# EAGLE design B204X (EAGLE 6.6.0)
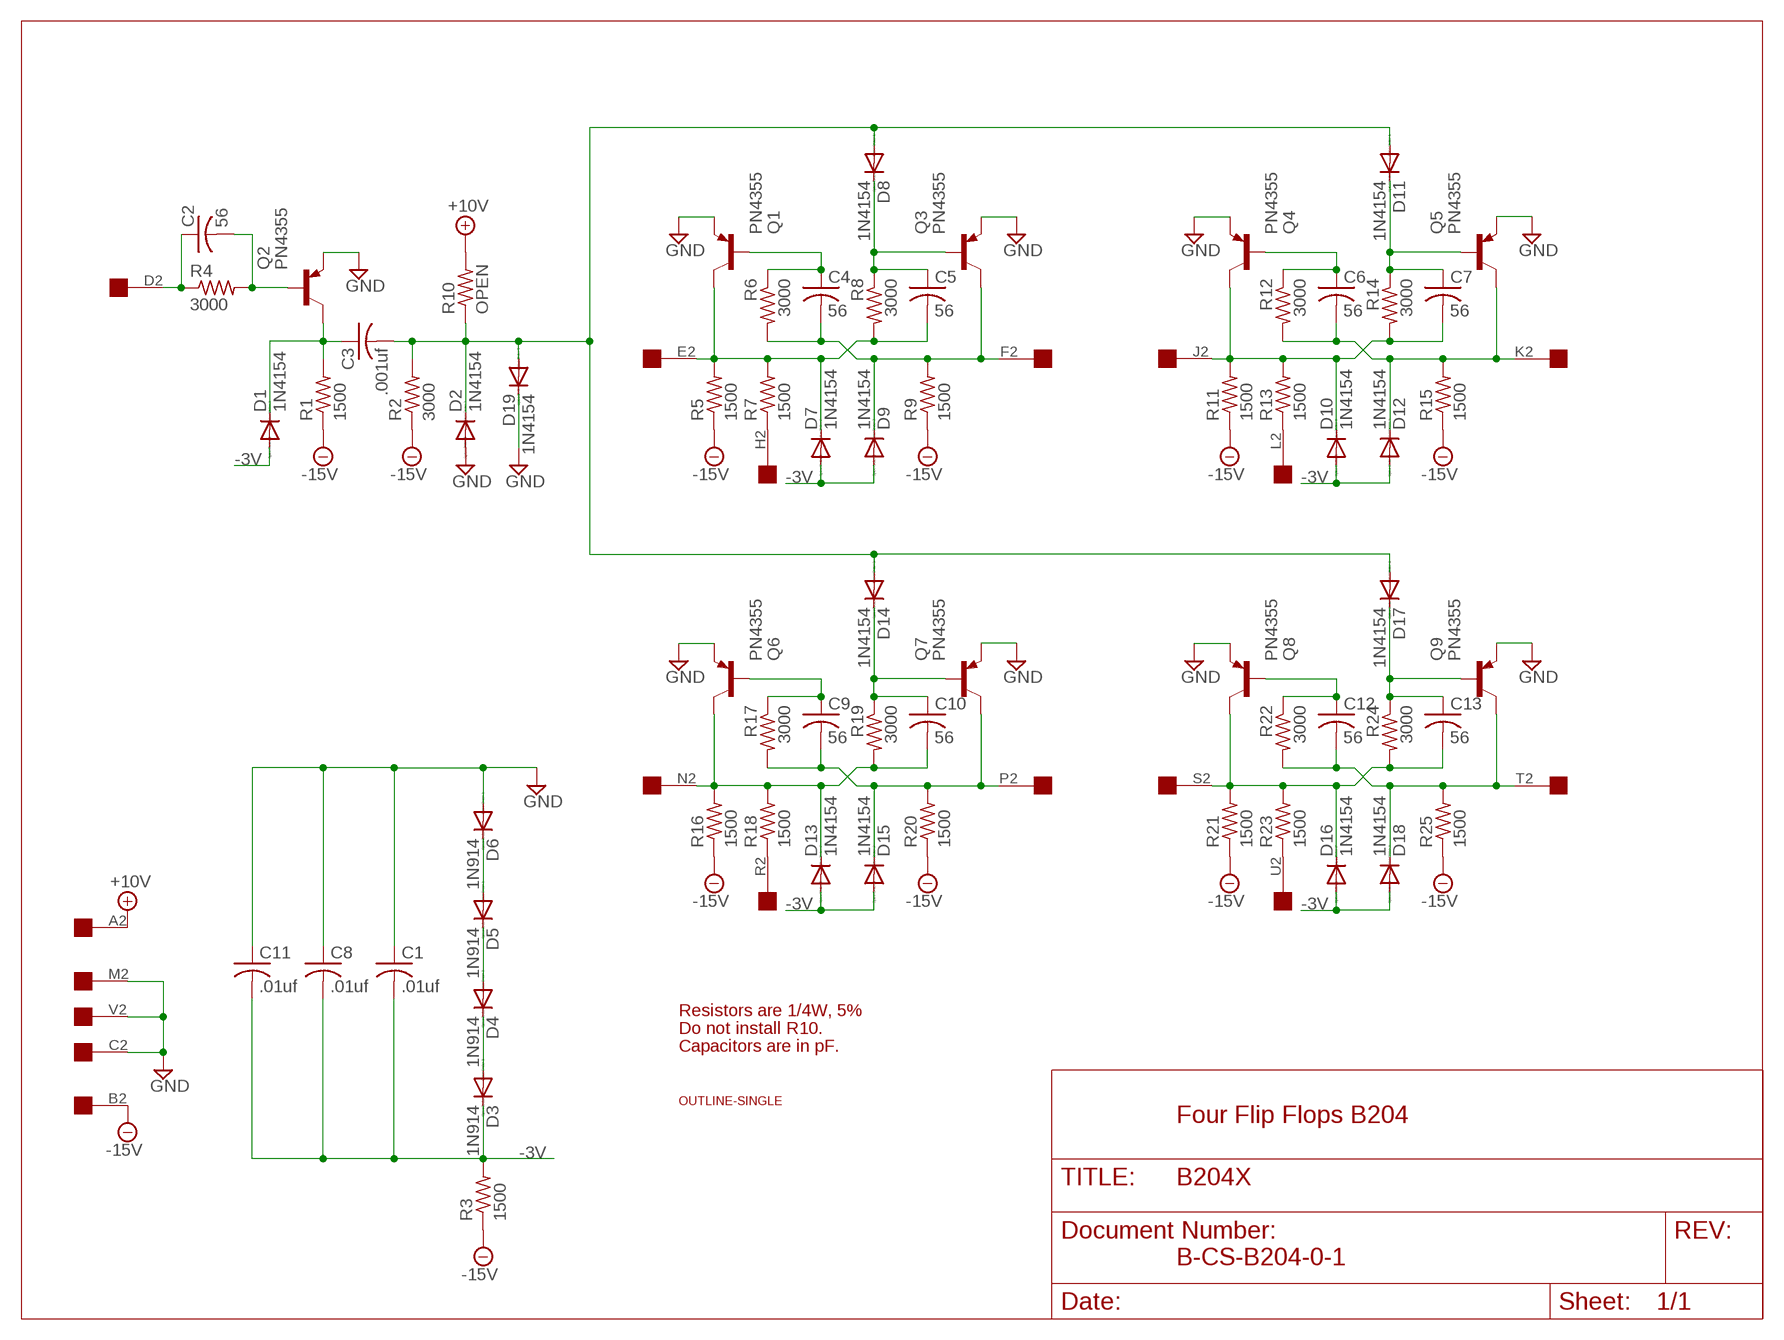
[diagram p0: schematic, sheet 1]

## Parts
C1  .01uf  C-US050-025X075  [C050-025X075]
C2  56  C-US075-032X103  [C075-032X103]
C3  .001uf  C-US050-025X075  [C050-025X075]
C4  56  C-US075-032X103  [C075-032X103]
C5  56  C-US075-032X103  [C075-032X103]
C6  56  C-US075-032X103  [C075-032X103]
C7  56  C-US075-032X103  [C075-032X103]
C8  .01uf  C-US050-025X075  [C050-025X075]
C9  56  C-US075-032X103  [C075-032X103]
C10  56  C-US075-032X103  [C075-032X103]
C11  .01uf  C-US050-025X075  [C050-025X075]
C12  56  C-US075-032X103  [C075-032X103]
C13  56  C-US075-032X103  [C075-032X103]
D1  1N4154  1N4148DO35-10  [DO35-10]
D2  1N4154  1N4148DO35-10  [DO35-10]
D3  1N914  1N4148DO35-10  [DO35-10]
D4  1N914  1N4148DO35-10  [DO35-10]
D5  1N914  1N4148DO35-10  [DO35-10]
D6  1N914  1N4148DO35-10  [DO35-10]
D7  1N4154  1N4148DO35-10  [DO35-10]
D8  1N4154  1N4148DO35-10  [DO35-10]
D9  1N4154  1N4148DO35-10  [DO35-10]
D10  1N4154  1N4148DO35-10  [DO35-10]
D11  1N4154  1N4148DO35-10  [DO35-10]
D12  1N4154  1N4148DO35-10  [DO35-10]
D13  1N4154  1N4148DO35-10  [DO35-10]
D14  1N4154  1N4148DO35-10  [DO35-10]
D15  1N4154  1N4148DO35-10  [DO35-10]
D16  1N4154  1N4148DO35-10  [DO35-10]
D17  1N4154  1N4148DO35-10  [DO35-10]
D18  1N4154  1N4148DO35-10  [DO35-10]
D19  1N4154  1N4148DO35-10  [DO35-10]
Q1  PN4355  2N3637  [TO39]
Q2  PN4355  2N3637  [TO39]
Q3  PN4355  2N3637  [TO39]
Q4  PN4355  2N3637  [TO39]
Q5  PN4355  2N3637  [TO39]
Q6  PN4355  2N3637  [TO39]
Q7  PN4355  2N3637  [TO39]
Q8  PN4355  2N3637  [TO39]
Q9  PN4355  2N3637  [TO39]
R1  1500  R-US_0207/10  [0207/10]
R2  3000  R-US_0207/10  [0207/10]
R3  1500  R-US_0207/10  [0207/10]
R4  3000  R-US_0207/10  [0207/10]
R5  1500  R-US_0207/10  [0207/10]
R6  3000  R-US_0207/10  [0207/10]
R7  1500  R-US_0207/10  [0207/10]
R8  3000  R-US_0207/10  [0207/10]
R9  1500  R-US_0207/10  [0207/10]
R10  OPEN  R-US_0207/10  [0207/10]
R11  1500  R-US_0207/10  [0207/10]
R12  3000  R-US_0207/10  [0207/10]
R13  1500  R-US_0207/10  [0207/10]
R14  3000  R-US_0207/10  [0207/10]
R15  1500  R-US_0207/10  [0207/10]
R16  1500  R-US_0207/10  [0207/10]
R17  3000  R-US_0207/10  [0207/10]
R18  1500  R-US_0207/10  [0207/10]
R19  3000  R-US_0207/10  [0207/10]
R20  1500  R-US_0207/10  [0207/10]
R21  1500  R-US_0207/10  [0207/10]
R22  3000  R-US_0207/10  [0207/10]
R23  1500  R-US_0207/10  [0207/10]
R24  3000  R-US_0207/10  [0207/10]
R25  1500  R-US_0207/10  [0207/10]
U$1  OUTLINE-SINGLE  [SINGLE]
U$2  EDGE-1  [EDGE-CON1]

## Nets
+10V [Power]: R10.2 U$2.A2
-3V [Power]: C1.2 C8.2 C11.2 D1.A D3.C D7.A D9.A D10.A D12.A D13.A D15.A D16.A D18.A R3.2
-15V [Power]: R1.1 R2.1 R3.1 R5.1 R9.1 R11.1 R15.1 R16.1 R20.1 R21.1 R25.1 U$2.B2
GND [Power]: C1.1 C8.1 C11.1 D2.A D6.A D19.C Q1.1(E) Q2.1(E) Q3.1(E) Q4.1(E) Q5.1(E) Q6.1(E) Q7.1(E) Q8.1(E) Q9.1(E) U$2.C2 U$2.M2 U$2.V2
N$1: C2.1 R4.1 U$2.D2
N$2: C4.1 Q1.2(B) R6.1
N$3: C2.2 Q2.2(B) R4.2
N$4: C3.1 D1.C Q2.3(C) R1.2
N$5: R7.1 U$2.H2
N$6: C5.2 D7.C Q1.3(C) R5.2 R7.2 R8.2 U$2.E2
N$7: C5.1 D8.C Q3.2(B) R8.1
N$8: C3.2 D2.C D8.A D11.A D14.A D17.A D19.A R2.2 R10.1
N$9: C4.2 D9.C Q3.3(C) R6.2 R9.2 U$2.F2
N$10: R13.1 U$2.L2
N$12: C6.1 Q4.2(B) R12.1
N$13: D4.A D5.C
N$14: C7.1 D11.C Q5.2(B) R14.1
N$15: C7.2 D10.C Q4.3(C) R11.2 R13.2 R14.2 U$2.J2
N$16: D3.A D4.C
N$17: C6.2 D12.C Q5.3(C) R12.2 R15.2 U$2.K2
N$18: R18.1 U$2.R2
N$20: C9.1 Q6.2(B) R17.1
N$21: C10.1 D14.C Q7.2(B) R19.1
N$22: C10.2 D13.C Q6.3(C) R16.2 R18.2 R19.2 U$2.N2
N$23: C9.2 D15.C Q7.3(C) R17.2 R20.2 U$2.P2
N$24: R23.1 U$2.U2
N$26: C12.1 Q8.2(B) R22.1
N$27: C13.1 D17.C Q9.2(B) R24.1
N$28: C13.2 D16.C Q8.3(C) R21.2 R23.2 R24.2 U$2.S2
N$29: C12.2 D18.C Q9.3(C) R22.2 R25.2 U$2.T2
N$31: D5.A D6.C

## Notes on the sheet
- Resistors are 1/4W, 5%
- Do not install R10.
- Capacitors are in pF.
- Four Flip Flops B204
- B-CS-B204-0-1

## Library data of the parts
C1-C13 = rcl:C-US: CAPACITOR, American symbol
D1-D19 = diode:1N4148: DIODE high speed (Philips)
Q1-Q9 = transistor-pnp:2N3637*: PNP Transistror
R1-R25 = rcl:R-US_: RESISTOR, American symbol
U$1 = dec-con:OUTLINE-*: Board outlines for DEC boards.
U$2 = dec-con:EDGE-1: Single-Sided DEC Edge Connector -- (side 2)

## Net classes
1 Power: width 0.813 mm

## Board
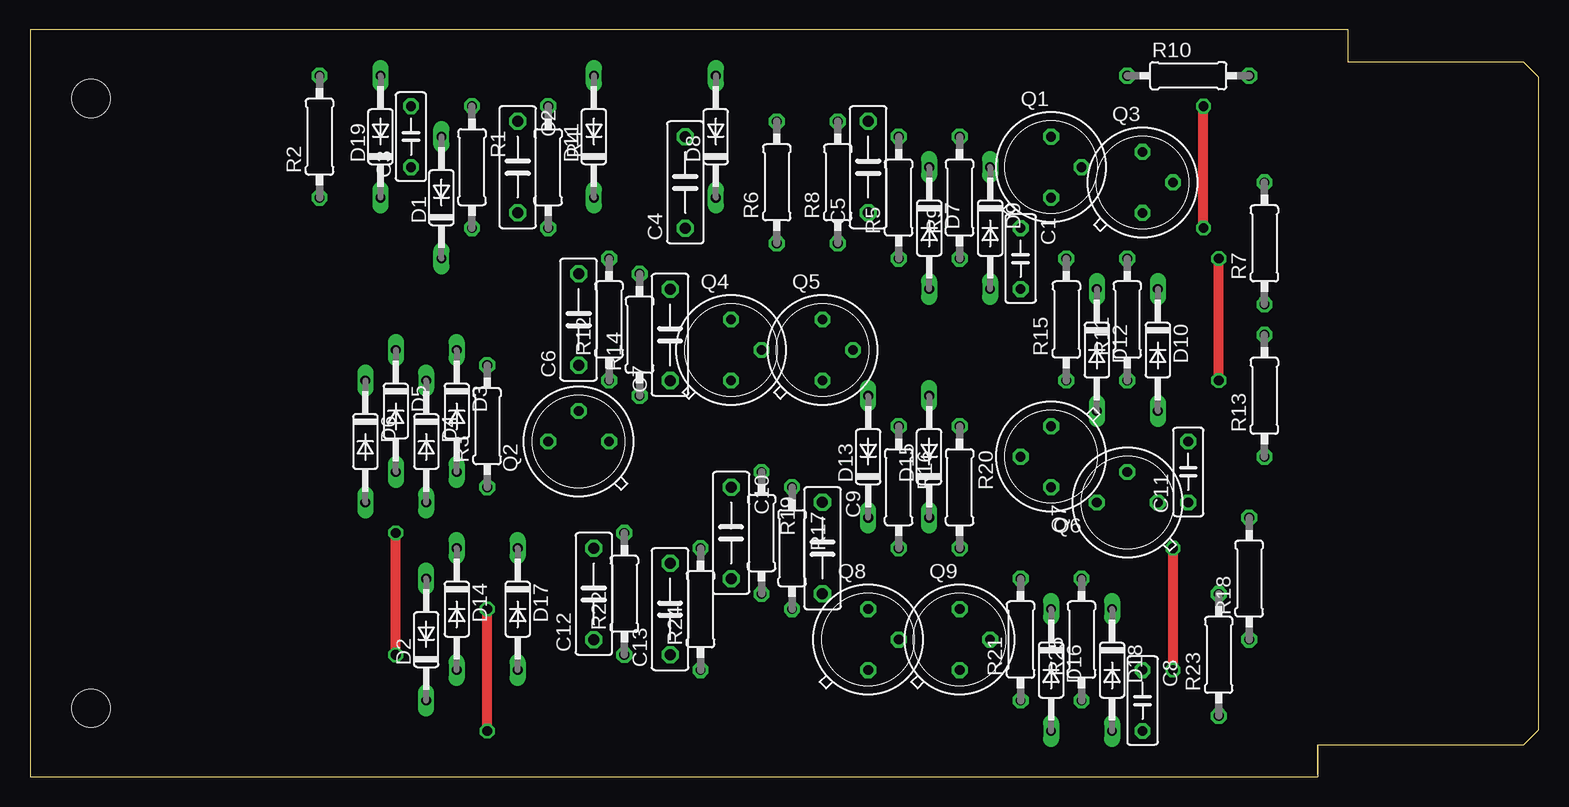
[diagram p1: board, top side]
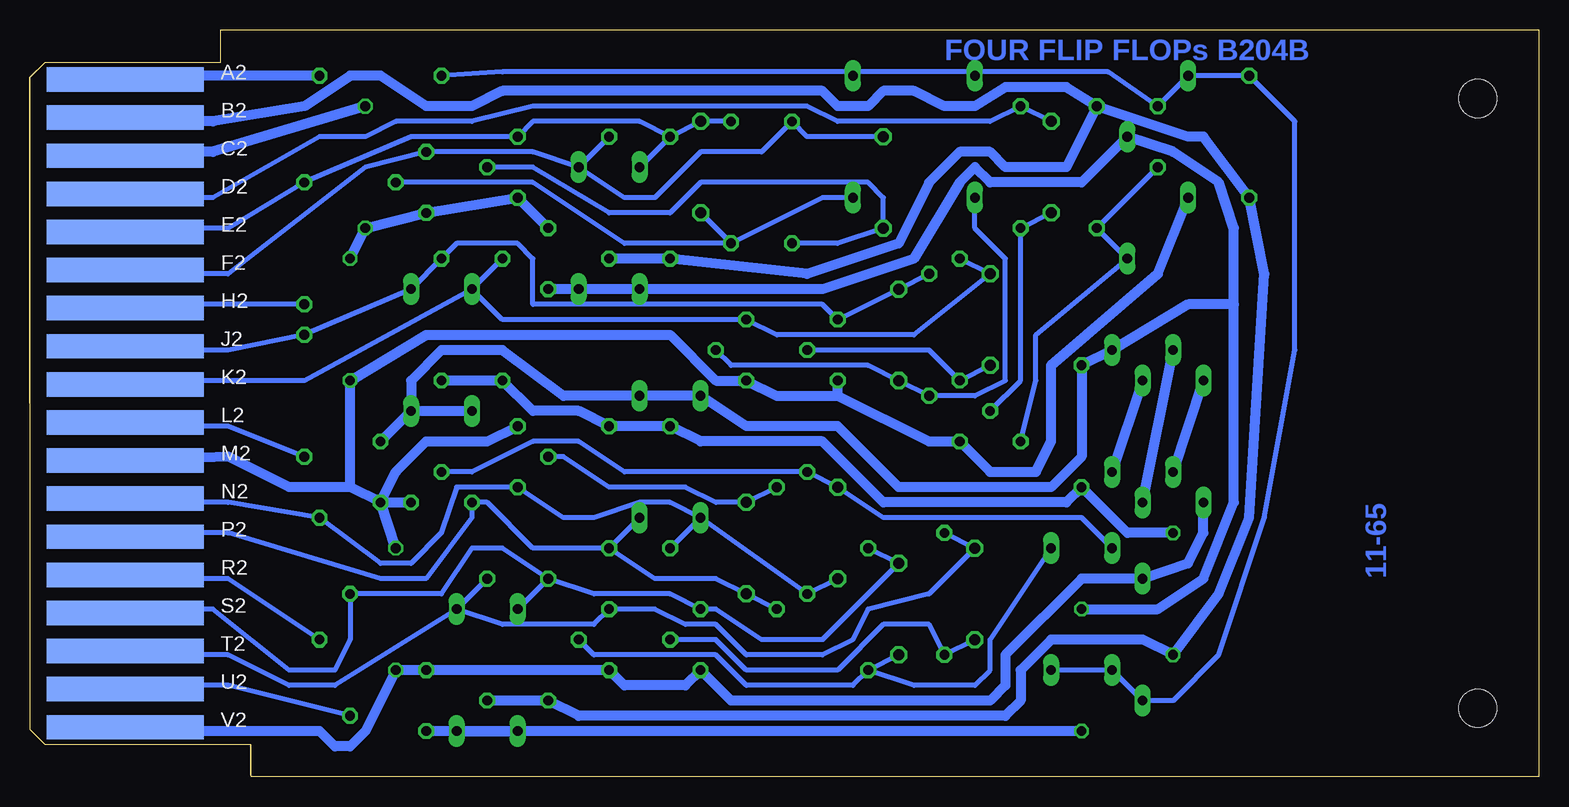
[diagram p2: board, bottom side, seen from below]

Size 125.73 x 62.23 mm. Coordinates in mm from the lower left corner, seen from the top.
Copper layers (1+16): Top 0.035mm / dielectric 1.5mm / Bottom 0.035mm
Design rules "16mils": minimum track width 16mil, minimum drill 32mil, track to track 15mil, track to pad 10mil, pad to pad 10mil, via to via 10mil, smd to smd 10mil, copper to edge 13mil, drill to drill 10mil, minimum pad ring 10mil, minimum via ring 8mil, stop-mask expansion 0mil, vias tented up to drill 0mil, thermal gap 10mil

### Footprints (pad centres in the part's own frame; a part is rotated, then mirrored left to right if it is on the bottom)
C050-025X075 = drill 0.813 octagon: 1 -2.54,0; 2 2.54,0
C075-032X103 = drill 0.914 octagon: 1 -3.81,0; 2 3.81,0
DO35-10 = drill 0.813 long: A 5.08,0; C -5.08,0
TO39 = drill 0.813 octagon: 1 0,-2.54; 2 2.54,0; 3 0,2.54
0207/10 = drill 0.813 octagon: 1 -5.08,0; 2 5.08,0
SINGLE = hole 3.175: 120.65,56.515; 120.65,5.715
EDGE-CON1 = smd 13.106 x 2.032 bottom: A2 7.938,4.128; B2 7.938,7.303; C2 7.938,10.477; D2 7.938,13.652; E2 7.938,16.828; F2 7.938,20.003; H2 7.938,23.177; J2 7.938,26.352; K2 7.938,29.527; L2 7.938,32.703; M2 7.938,35.877; N2 7.938,39.053; P2 7.938,42.227; R2 7.938,45.403; S2 7.938,48.578; T2 7.938,51.752; U2 7.938,54.928; V2 7.938,58.102

### Placement (x,y rotation side)
C1  82.55,43.18 270 top
C2  40.64,50.8 270 top
C3  31.75,53.34 90 top
C4  54.61,49.53 90 top
C5  69.85,50.8 90 top
C6  45.72,38.1 90 top
C7  53.34,36.83 90 top
C8  92.71,6.35 270 top
C9  66.04,19.05 270 top
C10  58.42,20.32 270 top
C11  96.52,25.4 90 top
C12  46.99,15.24 90 top
C13  53.34,13.97 90 top
D1  34.29,48.26 90 top
D2  33.02,11.43 90 top
D3  35.56,30.48 270 top
D4  33.02,27.94 270 top
D5  30.48,30.48 270 top
D6  27.94,27.94 270 top
D7  74.93,45.72 270 top
D8  57.15,53.34 90 top
D9  80.01,45.72 270 top
D10  93.98,35.56 270 top
D11  46.99,53.34 90 top
D12  88.9,35.56 270 top
D13  69.85,26.67 90 top
D14  35.56,13.97 270 top
D15  74.93,26.67 90 top
D16  85.09,8.89 270 top
D17  40.64,13.97 270 top
D18  90.17,8.89 270 top
D19  29.21,53.34 90 top
Q1  85.09,50.8 0 top
Q2  45.72,27.94 90 top
Q3  92.71,49.53 0 top
Q4  58.42,35.56 0 top
Q5  66.04,35.56 0 top
Q6  85.09,26.67 180 top
Q7  91.44,22.86 90 top
Q8  69.85,11.43 0 top
Q9  77.47,11.43 0 top
R1  36.83,50.8 270 top
R2  24.13,53.34 90 top
R3  38.1,29.21 90 top
R4  43.18,50.8 270 top
R5  72.39,48.26 90 top
R6  62.23,49.53 90 top
R7  102.87,44.45 90 top
R8  67.31,49.53 90 top
R9  77.47,48.26 90 top
R10  96.52,58.42 0 top
R11  91.44,38.1 90 top
R12  48.26,38.1 90 top
R13  102.87,31.75 90 top
R14  50.8,36.83 90 top
R15  86.36,38.1 90 top
R16  72.39,24.13 270 top
R17  63.5,19.05 270 top
R18  101.6,16.51 90 top
R19  60.96,20.32 270 top
R20  77.47,24.13 270 top
R21  82.55,11.43 90 top
R22  49.53,15.24 90 top
R23  99.06,10.16 90 top
R24  55.88,13.97 90 top
R25  87.63,11.43 90 top
U$1  125.73,62.23 180 top
U$2  125.73,62.23 180 top

### Tracks (layer width: path | path; a pad name or v marks a point on that pad's centre or on a via)
+10V
  Bottom 0.813: U$2.A2 116.84,58.42 R10.2
-3V  (via drill 0.81)
  Top 0.813: v38.1,3.81 v38.1,13.97
  Bottom 0.813: 25.4,39.37 29.21,39.37 D3.C R3.2 38.1,26.67 40.64,24.13 53.34,24.13 58.42,29.21 66.04,29.21 D13.A D15.A 81.28,31.75 86.36,35.56 91.44,35.56 93.98,33.02 D10.A | 25.4,39.37 25.4,22.86 27.94,16.51 31.75,13.97 v38.1,13.97 | 25.4,39.37 25.4,45.72 26.67,49.53 30.48,52.07 D1.A 38.1,49.53 45.72,49.53 46.99,50.8 48.26,49.53 52.07,43.18 59.69,40.64 D7.A D9.A C1.2 | D10.A D12.A | D10.A C11.2 | D18.A D16.A | v38.1,3.81 D18.A | D18.A C8.2
-15V  (via drill 0.81)
  Top 0.813: v30.48,10.16 v30.48,20.32
  Bottom 0.813: v30.48,20.32 34.29,20.32 R3.1 39.37,22.86 54.61,22.86 59.69,27.94 69.85,27.94 R16.1 R20.1 80.01,30.48 83.82,30.48 R15.1 R11.1 | R1.1 29.21,53.34 27.94,53.34 R2.1 22.86,41.91 24.13,21.59 26.67,15.24 v30.48,10.16 33.02,11.43 40.64,11.43 43.18,8.89 43.18,6.35 44.45,5.08 80.01,5.08 R21.1 R25.1 | R1.1 39.37,50.8 44.45,50.8 45.72,52.07 48.26,52.07 50.8,49.53 53.34,44.45 60.96,41.91 R5.1 R9.1 | U$2.B2 115.57,54.61 110.49,54.61 102.87,55.88 99.06,58.42 96.52,58.42 92.71,55.88 88.9,55.88 86.36,57.15 59.69,57.15 58.42,55.88 55.88,55.88 54.61,57.15 52.07,57.15 49.53,55.88 46.99,55.88 44.45,57.47 39.37,57.47 R1.1
GND  (via drill 0.81)
  Top 0.813: v97.79,45.72 v97.79,55.88 | v99.06,33.02 v99.06,43.18 | v95.25,8.89 v95.25,19.05
  Bottom 0.813: U$2.V2 116.84,3.81 101.6,3.81 100.33,2.54 99.06,2.54 97.79,3.81 v95.25,8.89 C8.1 Q9.1 76.2,7.62 71.12,7.62 Q8.1 67.31,6.35 45.72,6.35 44.45,7.62 44.45,10.16 38.1,16.51 D2.A 29.21,17.78 27.94,20.32 D6.A | U$2.C2 116.84,52.07 110.49,52.07 v97.79,55.88 | U$2.M2 109.22,26.67 104.14,24.13 99.06,24.13 | C11.1 99.06,24.13 | v95.25,19.05 C11.1 | 99.06,24.13 v99.06,33.02 92.71,36.83 72.39,36.83 68.58,33.02 Q5.1 63.5,31.75 58.42,31.75 | 58.42,31.75 Q4.1 | 58.42,31.75 50.8,27.94 Q2.1 45.72,25.4 41.91,25.4 40.64,27.94 40.64,34.29 31.75,41.91 D19.C | C11.1 Q7.1 | C11.1 95.25,25.4 92.71,27.94 87.63,27.94 Q6.1 | v99.06,43.18 v97.79,45.72 Q3.1 Q1.1 C1.1
N$1
  Bottom 0.406: U$2.D2 116.84,48.26 110.49,48.26 101.6,53.34 97.79,53.34 95.25,54.61 88.9,54.61 83.82,55.88 60.96,55.88 58.42,54.61 45.72,54.61 R4.1 C2.1
N$2
  Bottom 0.406: Q1.2 83.82,50.8 77.47,46.99 72.39,46.99 69.85,49.53 55.88,49.53 54.61,48.26 C4.1 58.42,44.45 R6.1
N$3
  Bottom 0.406: C2.2 R4.2 43.18,33.02 Q2.2
N$4
  Bottom 0.406: Q2.3 41.91,33.02 41.91,36.83 D1.C R1.2 C3.1
N$5
  Bottom 0.406: U$2.H2 116.84,39.37 R7.1
N$6
  Bottom 0.406: U$2.E2 116.84,45.72 109.22,45.72 R7.2 93.98,53.34 Q1.3 83.82,54.61 74.93,54.61 R5.2 | R8.2 C5.2 R5.2 | R5.2 D7.C
N$7
  Bottom 0.406: Q3.2 83.82,49.53 76.2,44.45 R8.1 | D8.C 59.69,48.26 R8.1 | R8.1 C5.1
N$8
  Bottom 0.406: 46.99,58.74 35.88,58.74 C3.2 D19.A R2.2 20.32,54.61 20.32,35.56 22.86,21.59 26.67,10.16 30.48,6.35 D2.C D14.A D17.A | 46.99,58.74 57.15,58.74 | 57.15,58.74 86.36,58.74 R10.1 | 57.15,58.74 D8.A | 46.99,58.74 D11.A
N$9
  Bottom 0.406: U$2.F2 116.84,41.91 109.22,41.91 97.79,50.8 Q3.3 83.82,52.07 D9.C | D9.C R9.2 | D9.C 76.2,48.26 73.66,48.26 69.85,52.07 64.77,52.07 R6.2 60.96,53.34 C4.2
N$10
  Bottom 0.406: U$2.L2 116.84,29.21 109.22,29.21 R13.1
N$12
  Bottom 0.406: C6.1 R12.1 50.8,35.56 Q4.2
N$13
  Bottom 0.813: D4.A D5.C
N$14
  Bottom 0.406: Q5.2 67.31,34.29 55.88,34.29 C7.1 R14.1 46.99,31.75 44.45,33.02 44.45,43.18 46.99,45.72 D11.C
N$15
  Bottom 0.406: U$2.J2 116.84,35.56 109.22,35.56 R13.2 D10.C R11.2 90.17,44.45 85.09,44.45 83.82,43.18 83.82,39.37 59.69,39.37 Q4.3 C7.2 R14.2
N$16
  Bottom 0.813: D3.A D4.C
N$17
  Bottom 0.406: U$2.K2 116.84,33.02 102.87,33.02 D12.C | D12.C 86.36,38.1 Q5.3 63.5,36.83 52.07,36.83 C6.2 R12.2 | D12.C R15.2
N$18
  Bottom 0.406: U$2.R2 116.84,16.51 109.22,16.51 R18.1
N$20
  Bottom 0.406: R17.1 C9.1 68.58,22.86 71.12,24.13 77.47,24.13 81.28,26.67 Q6.2
N$21
  Bottom 0.406: D14.C 38.1,21.59 54.61,21.59 C10.1 R19.1 76.2,25.4 80.01,27.94 83.82,27.94 88.9,25.4 Q7.2
N$22
  Bottom 0.406: U$2.N2 116.84,22.86 109.22,22.86 R18.2 96.52,17.78 93.98,17.78 91.44,20.32 90.17,24.13 Q6.3 81.28,21.59 78.74,21.59 74.93,22.86 72.39,22.86 D13.C | D13.C R16.2 | D13.C R19.2 C10.2
N$23
  Bottom 0.406: U$2.P2 116.84,20.32 109.22,20.32 96.52,16.51 92.71,16.51 88.9,21.59 Q7.3 87.63,22.86 83.82,19.05 R20.2 | R20.2 D15.C | R20.2 73.66,16.51 68.58,16.51 C9.2 R17.2
N$24
  Bottom 0.406: U$2.U2 116.84,7.62 109.22,7.62 R23.1
N$26
  Bottom 0.406: Q8.2 68.58,11.43 66.04,8.89 58.42,8.89 54.61,12.7 50.8,12.7 R22.1 C12.1
N$27
  Bottom 0.406: Q9.2 78.74,10.16 68.58,10.16 66.04,7.62 57.15,7.62 R24.1 | R24.1 C13.1 R24.1 | D17.C 45.72,11.43 45.72,8.89 46.99,7.62 52.07,7.62 R24.1
N$28
  Bottom 0.406: U$2.S2 115.57,13.97 110.49,13.97 104.14,8.89 100.33,8.89 99.06,11.43 R23.2 91.44,15.24 88.9,19.05 86.36,19.05 R21.2 | R21.2 D16.C R21.2 | R21.2 78.74,15.24 72.39,15.24 Q8.3 68.58,13.97 64.77,11.43 59.69,11.43 C13.2 R24.2
N$29
  Bottom 0.406: U$2.T2 116.84,10.16 109.22,10.16 104.14,7.62 100.33,7.62 D18.C | D18.C 86.36,12.7 78.74,12.7 Q9.3 73.66,13.97 71.12,12.7 68.58,12.7 66.04,10.16 59.69,10.16 57.15,11.43 55.88,13.97 50.8,15.24 C12.2 R22.2 | D18.C R25.2
N$31
  Bottom 0.813: D5.A D6.C

### Text on the board
Bottom: FOUR FLIP FLOPs B204B | 11-65